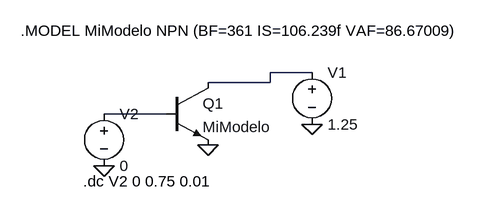
[diagram p0: schematic tbjpropio(ICvsVBE).asc]
tbjpropio(ICvsVBE).asc, the LTspice schematic file:
Version 4
SHEET 1 956 680
WIRE 352 112 288 112
WIRE 288 128 288 112
WIRE 288 128 192 128
WIRE 128 176 32 176
FLAG 192 224 0
FLAG 352 192 0
FLAG 32 256 0
SYMBOL voltage 352 96 R0
WINDOW 123 0 0 Left 2
WINDOW 39 0 0 Left 2
SYMATTR InstName V1
SYMATTR Value 1.25
SYMBOL voltage 32 160 R0
WINDOW 123 0 0 Left 2
WINDOW 39 0 0 Left 2
SYMATTR InstName V2
SYMATTR Value 0
SYMBOL npn 128 128 R0
SYMATTR InstName Q1
SYMATTR Value MiModelo
TEXT 0 280 Left 2 !.dc V2 0 0.75 0.01
TEXT -96 48 Left 2 !.MODEL MiModelo NPN (BF=361 IS=106.239f VAF=86.67009)

The netlist it stands for:
* tbjpropio(ICvsVBE).asc
V1 N001 0 1.25
V2 N002 0 0
Q1 N001 N002 0 0 MiModelo
.model NPN NPN
.model PNP PNP
.lib standard.bjt
.dc V2 0 0.75 0.01
.MODEL MiModelo NPN (BF=361 IS=106.239f VAF=86.67009)
.backanno
.end